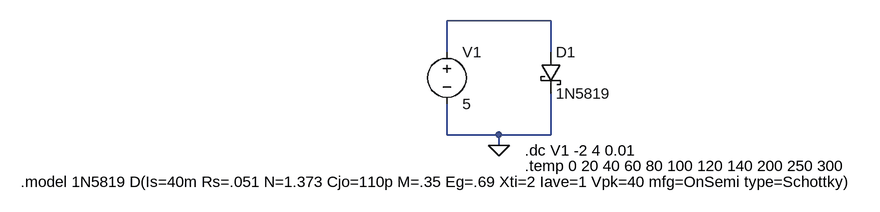
[diagram p0: schematic 1_d_Diodo_Schottky_Analisis_temp_e_is_differentes.asc]
1_d_Diodo_Schottky_Analisis_temp_e_is_differentes.asc, the LTspice schematic file:
Version 4
SHEET 1 880 680
WIRE 240 16 80 16
WIRE 80 64 80 16
WIRE 240 64 240 16
WIRE 80 192 80 144
WIRE 160 192 80 192
WIRE 240 192 240 128
WIRE 240 192 160 192
WIRE 160 208 160 192
FLAG 160 208 0
SYMBOL voltage 80 48 R0
WINDOW 123 0 0 Left 0
WINDOW 39 0 0 Left 0
SYMATTR InstName V1
SYMATTR Value 5
SYMBOL schottky 224 64 R0
SYMATTR InstName D1
SYMATTR Value 1N5819
SYMATTR Description Diode
SYMATTR Type diode
TEXT 200 216 Left 2 !.dc V1 -2 4 0.01
TEXT 200 240 Left 2 !.temp 0 20 40 60 80 100 120 140 200 250 300
TEXT -576 264 Left 2 !.model 1N5819 D(Is=40m Rs=.051 N=1.373 Cjo=110p M=.35 Eg=.69 Xti=2 Iave=1 Vpk=40 mfg=OnSemi type=Schottky)

The netlist it stands for:
* 1_d_Diodo_Schottky_Analisis_temp_e_is_differentes.asc
V1 N001 0 5
D1 N001 0 1N5819
.model D D
.lib standard.dio
.dc V1 -2 4 0.01
.temp 0 20 40 60 80 100 120 140 200 250 300
.model 1N5819 D(Is=40m Rs=.051 N=1.373 Cjo=110p M=.35 Eg=.69 Xti=2 Iave=1 Vpk=40 mfg=OnSemi type=Schottky)
.backanno
.end